# EAGLE schematic hw-proto02 (EAGLE 7.3.0)
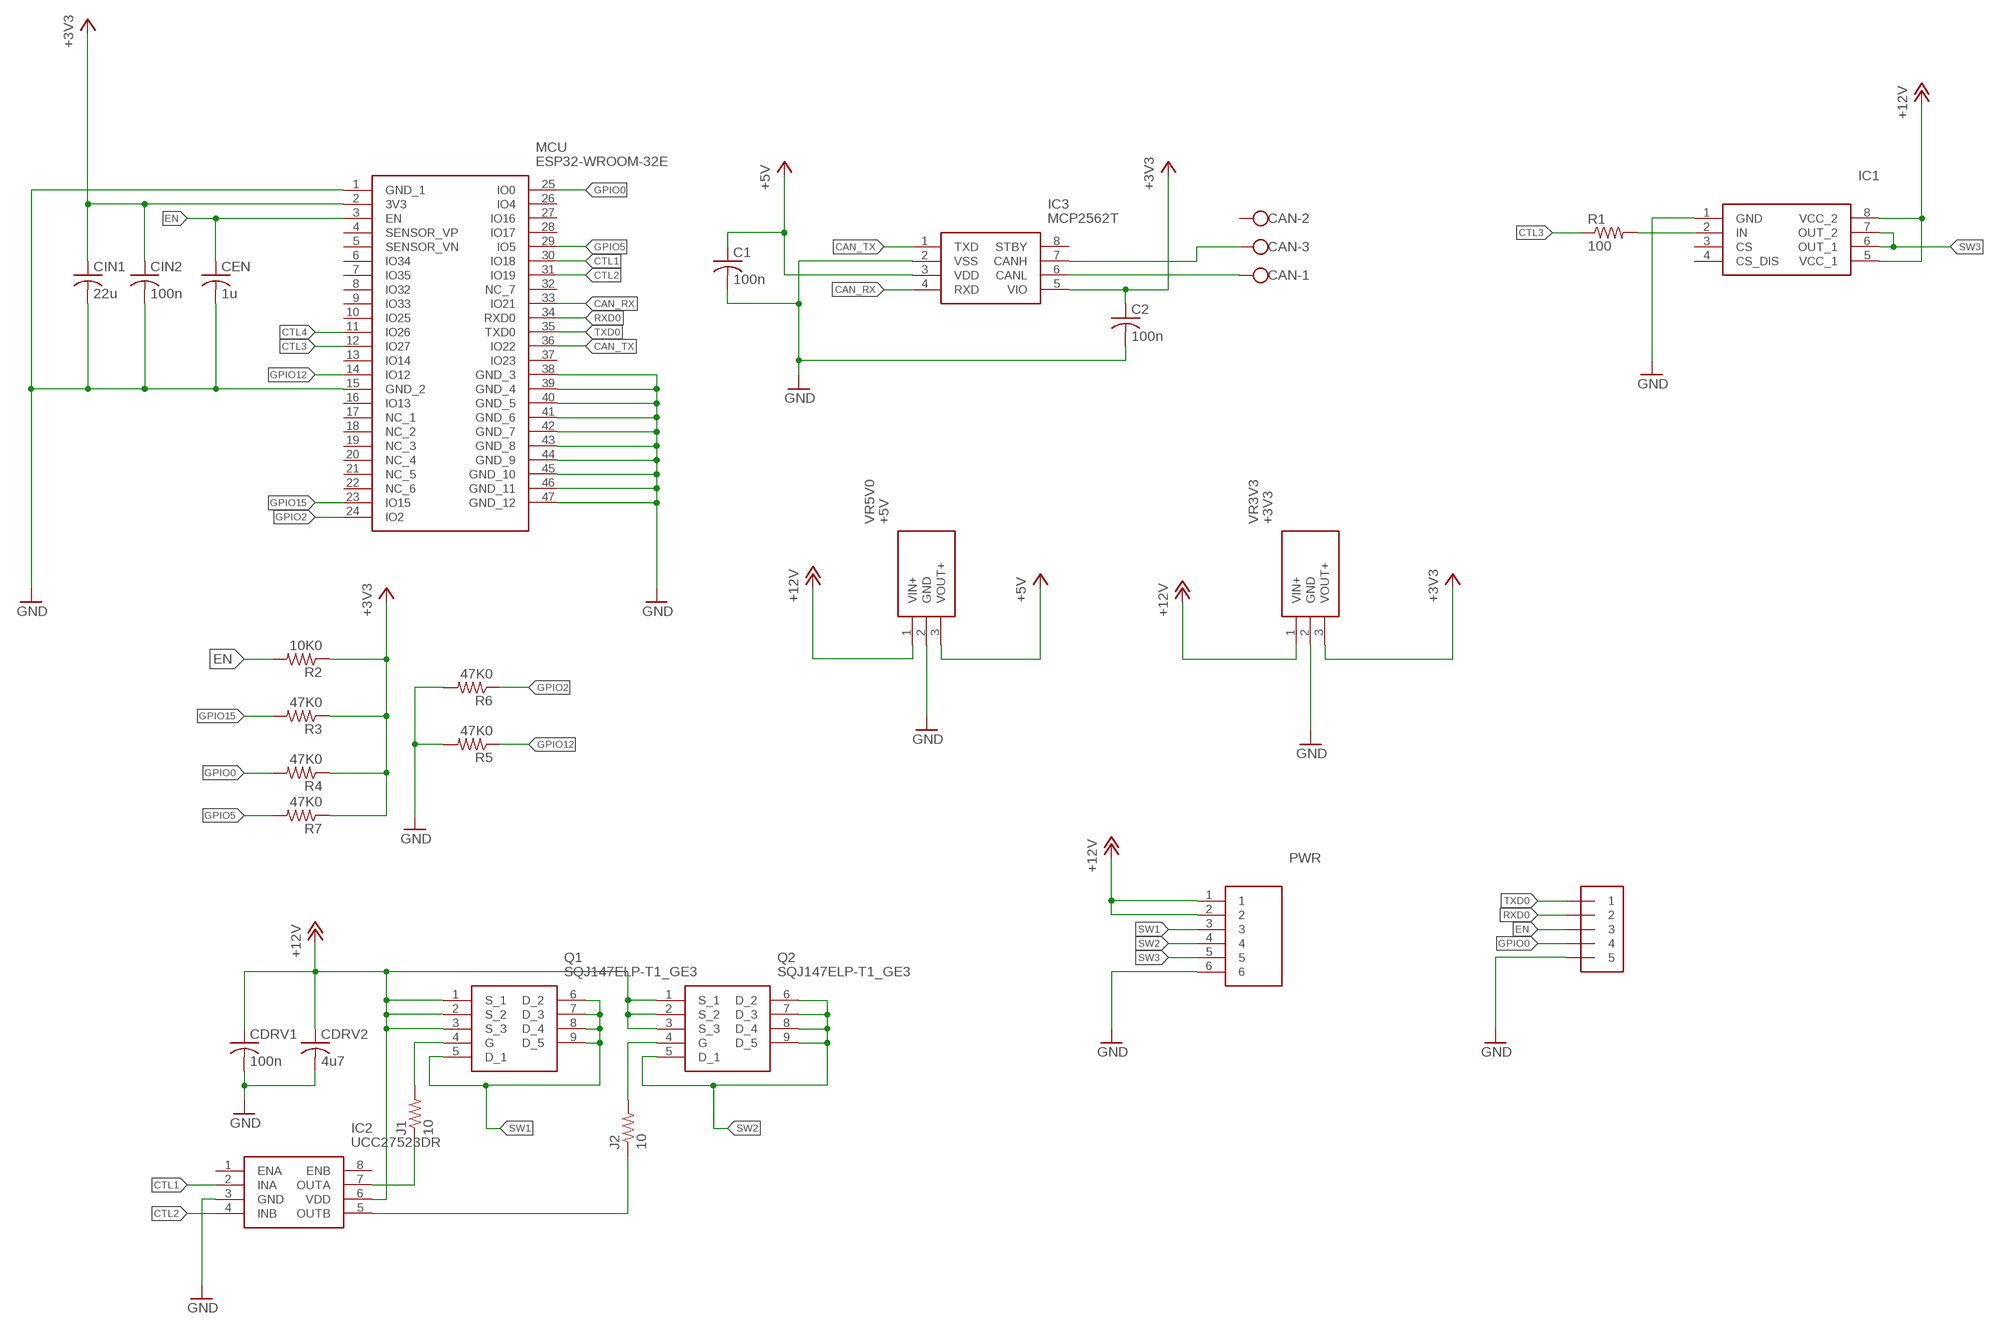
[diagram p0: schematic, sheet 1]

## Parts
C1  100n  C-USC0603K  [C0603K]
C2  100n  C-USC0603K  [C0603K]
CAN  W237-103  [W237-103]
CDRV1  100n  C-USC0603K  [C0603K]
CDRV2  4u7  C-USC0805K  [C0805K]
CEN  1u  C-USC0603K  [C0603K]
CIN1  22u  C-USC0805K  [C0805K]
CIN2  100n  C-USC0603K  [C0603K]
IC1  VN5E160MSTR-E  [SOIC127P600X175-8N]
IC2  UCC27523DR  [SOIC127P600X175-8N]
IC3  MCP2562T  MCP2562T-H_SN  [SOIC127P600X175-8N]
J1  10  R-US_0204/7  [0204/7]
J2  10  R-US_0204/7  [0204/7]
MCU  ESP32-WROOM-32E  ESP32-WROOM-32E-N8R2  [ESP32WROOM32EN8R2]
PROG  1X5  [1X05-3.5MM]
PWR  4DB-P108-06  [4DBP10806]
Q1  SQJ147ELP-T1_GE3  [SQJ147ELPT1_GE3]
Q2  SQJ147ELP-T1_GE3  [SQJ147ELPT1_GE3]
R1  100  R-US_0204/7  [0204/7]
R2  10K0  R-US_R0603  [R0603]
R3  47K0  R-US_R0603  [R0603]
R4  47K0  R-US_R0603  [R0603]
R5  47K0  R-US_R0603  [R0603]
R6  47K0  R-US_R0603  [R0603]
R7  47K0  R-US_R0603  [R0603]
VR3V3  +3V3  TSR_1-2433E  [TSR-1-2433]
VR5V0  +5V  TSR_1-2433E  [TSR-1-2433]

## Nets
+3V3: C2.1 CIN1.1 CIN2.1 IC3.5(VIO) MCU.2(3V3) R2.1 R3.1 R4.1 R7.1 VR3V3.3(VOUT+)
+5V: C1.1 IC3.3(VDD) VR5V0.3(VOUT+)
+12V: CDRV1.1 CDRV2.1 IC1.5(VCC_1) IC1.8(VCC_2) IC2.6(VDD) PWR.1 PWR.2 Q1.1(S_1) Q1.2(S_2) Q1.3(S_3) Q2.1(S_1) Q2.2(S_2) Q2.3(S_3) VR3V3.1(VIN+) VR5V0.1(VIN+)
CAN_RX: IC3.4(RXD) MCU.33(IO21)
CAN_TX: IC3.1(TXD) MCU.36(IO22)
CTL1: IC2.2(INA) MCU.30(IO18)
CTL2: IC2.4(INB) MCU.31(IO19)
CTL3: MCU.12(IO27) R1.1
CTL4: MCU.11(IO26)
EN: CEN.1 MCU.3(EN) PROG.3 R2.2
GND: C1.2 C2.2 CDRV1.2 CDRV2.2 CEN.2 CIN1.2 CIN2.2 IC1.1(GND) IC2.3(GND) IC3.2(VSS) MCU.1(GND_1) MCU.15(GND_2) MCU.38(GND_3) MCU.39(GND_4) MCU.40(GND_5) MCU.41(GND_6) MCU.42(GND_7) MCU.43(GND_8) MCU.44(GND_9) MCU.45(GND_10) MCU.46(GND_11) MCU.47(GND_12) PROG.5 PWR.6 R5.2 R6.2 VR3V3.2(GND) VR5V0.2(GND)
GPIO0: MCU.25(IO0) PROG.4 R4.2
GPIO2: MCU.24(IO2) R6.1
GPIO5: MCU.29(IO5) R7.2
GPIO12: MCU.14(IO12) R5.1
GPIO15: MCU.23(IO15) R3.2
N$1: CAN.3 IC3.7(CANH)
N$2: CAN.1 IC3.6(CANL)
N$3: IC2.5(OUTB) J2.1
N$4: IC2.7(OUTA) J1.1
N$5: J1.2 Q1.4(G)
N$6: J2.2 Q2.4(G)
N$7: IC1.2(IN) R1.2
RXD0: MCU.34(RXD0) PROG.2
SW1: PWR.3 Q1.5(D_1) Q1.6(D_2) Q1.7(D_3) Q1.8(D_4) Q1.9(D_5)
SW2: PWR.4 Q2.5(D_1) Q2.6(D_2) Q2.7(D_3) Q2.8(D_4) Q2.9(D_5)
SW3: IC1.6(OUT_1) IC1.7(OUT_2) PWR.5
TXD0: MCU.35(TXD0) PROG.1
Unconnected: CAN.2 IC1.3(CS) IC1.4(CS_DIS) IC2.1(ENA) IC2.8(ENB) IC3.8(STBY) MCU.4(SENSOR_VP) MCU.5(SENSOR_VN) MCU.6(IO34) MCU.7(IO35) MCU.8(IO32) MCU.9(IO33) MCU.10(IO25) MCU.13(IO14) MCU.16(IO13) MCU.17(NC_1) MCU.18(NC_2) MCU.19(NC_3) MCU.20(NC_4) MCU.21(NC_5) MCU.22(NC_6) MCU.26(IO4) MCU.27(IO16) MCU.28(IO17) MCU.32(NC_7) MCU.37(IO23)

## Library data of the parts
C1 C2 CDRV1 CDRV2 CEN CIN1 CIN2 = rcl:C-US: CAPACITOR, American symbol
CAN = con-wago-500:W237-103: WAGO SCREW CLAMP; MPN: 237-103; OC_FARNELL: unknown; OC_NEWARK: 18M7116
IC1 = VN5E160MSTR-E:VN5E160MSTR-E: Gate Drivers SNGL CH HI-SIDE DRVR W/ANALOG CRRNT SNSE Source: Datasheet <https://componentsearchengine.com/Datasheets/2/VN5E160MSTR-E.pdf>; DESCRIPTION: Gate Drivers SNGL CH HI-SIDE DRVR W/ANALOG CRRNT SNSE; HEIGHT: 1.75mm; MANUFACTURER_NAME: STMicroelectronics; MANUFACTURER_PART_NUMBER: VN5E160MSTR-E; MOUSER_PART_NUMBER: 511-VN5E160MSTR-E; MOUSER_PRICE-STOCK: https://www.mouser.co.uk/ProductDetail/STMicroelectronics/VN5E160MSTR-E?qs=WSSg0AwdCh77XxtxsYEeyw%3D%3D
IC2 = UCC27523DR-fet-driver:UCC27523DR: Dual, 5A, High-Speed Low-Side Power MOSFET Driver Source: Datasheet <http://www.ti.com/lit/gpn/ucc27523>; DESCRIPTION: Dual, 5A, High-Speed Low-Side Power MOSFET Driver; HEIGHT: 1.75mm; MANUFACTURER_NAME: Texas Instruments; MANUFACTURER_PART_NUMBER: UCC27523DR; MOUSER_PART_NUMBER: 595-UCC27523DR; MOUSER_PRICE-STOCK: https://www.mouser.co.uk/ProductDetail/Texas-Instruments/UCC27523DR/?qs=JK0Mn6q9DKQ5jNt3UHw5hw%3D%3D
IC3 = MCP2562T-H_SN:MCP2562T-H_SN: CAN Interface IC Source: Datasheet <https://componentsearchengine.com/Datasheets/1/MCP2562T-H_SN.pdf>; DESCRIPTION: CAN Interface IC; HEIGHT: 1.75mm; MANUFACTURER_NAME: Microchip; MANUFACTURER_PART_NUMBER: MCP2562T-H/SN; MOUSER_PART_NUMBER: 579-MCP2562T-H/SN; MOUSER_PRICE-STOCK: https://www.mouser.co.uk/ProductDetail/Microchip-Technology/MCP2562T-H-SN?qs=eTPcRhULBzwloCb8Xxk0jQ%3D%3D
J1 J2 R1-R7 = rcl:R-US_: RESISTOR, American symbol
MCU = ESP32-WROOM-32E-N8R2:ESP32-WROOM-32E-N8R2: Multiprotocol Modules ESP32-WROOM-32E integrates ESP32-D0WD-V3, with higher stability and safety performance. Source: Datasheet <https://www.espressif.com/sites/default/files/documentation/esp32-wroom-32e_esp32-wroom-32ue_datasheet_en.pdf>; DESCRIPTION: Multiprotocol Modules ESP32-WROOM-32E integrates ESP32-D0WD-V3, with higher stability and safety performance.; HEIGHT: 3.25mm; MANUFACTURER_NAME: Espressif Systems; MANUFACTURER_PART_NUMBER: ESP32-WROOM-32E-N8R2; MOUSER_PART_NUMBER: 356-ESP32WRM32EN8R2; MOUSER_PRICE-STOCK: https://www.mouser.co.uk/ProductDetail/Espressif-Systems/ESP32-WROOM-32E-N8R2?qs=By6Nw2ByBD0mvGJSS3Ohlw%3D%3D
PROG = adafruit:1X5
PWR = 4DB-P108-06:4DB-P108-06: Dual Barrier, Printed Circuit Pin, Wire-to-Board, 6 Position, 8.26 mm [.325 in] Centerline, 1 Row, Buchanan 4DB Series, Barrier Strips Source: Datasheet <https://www.te.com/commerce/DocumentDelivery/DDEController?Action=srchrtrv&DocNm=1-1773458-2_BARRIER_STRIPS_QRG&DocType=Data Sheet&DocLang=English&PartCntxt=2-1437667-9&DocFormat=pdf>; DESCRIPTION: Dual Barrier, Printed Circuit Pin, Wire-to-Board, 6 Position, 8.26 mm [.325 in] Centerline, 1 Row, Buchanan 4DB Series, Barrier Strips; HEIGHT: 13.716mm; MANUFACTURER_NAME: TE Connectivity; MANUFACTURER_PART_NUMBER: 4DB-P108-06; MOUSER_PART_NUMBER: N/A; MOUSER_PRICE-STOCK: https://www.mouser.co.uk/ProductDetail/TE-Connectivity/4DB-P108-06?qs=JZD3Rbs9Xzm1xbyNfnCHaQ%3D%3D
Q1 Q2 = transistor-vishay-pchan-pso8:SQJ147ELP-T1_GE3: MOSFET P-CHANNEL 40-V (D-S) 175C MOSFET Source: Datasheet <https://www.vishay.com/docs/77857/sqj147elp.pdf>; DESCRIPTION: MOSFET P-CHANNEL 40-V (D-S) 175C MOSFET; HEIGHT: 1.227mm; MANUFACTURER_NAME: Vishay; MANUFACTURER_PART_NUMBER: SQJ147ELP-T1_GE3; MOUSER_PART_NUMBER: 78-SQJ147ELP-T1_GE3; MOUSER_PRICE-STOCK: https://www.mouser.co.uk/ProductDetail/Vishay-Siliconix/SQJ147ELP-T1_GE3?qs=81r%252BiQLm7BRdyhBg3DuaKw%3D%3D
VR3V3 VR5V0 = TSR_1-2433E:TSR_1-2433E: 1 Amp POL converter, industrial, 6-36 VDC input, pos.-pos. circuit, cost efficient, LM78 compatible, SIP-3 Source: Datasheet <https://tracopower.com/tsr1e-datasheet/>; DESCRIPTION: 1 Amp POL converter, industrial, 6-36 VDC input, pos.-pos. circuit, cost efficient, LM78 compatible, SIP-3; HEIGHT: mm; MANUFACTURER_NAME: Traco Power; MANUFACTURER_PART_NUMBER: TSR 1-2433E; MOUSER_PART_NUMBER: 495-TSR1-2433E; MOUSER_PRICE-STOCK: https://www.mouser.co.uk/ProductDetail/TRACO-Power/TSR-1-2433E?qs=vmHwEFxEFR9haWIzn8wG3A%3D%3D